# Altium schematic sheet Signal Block Diagram.SchDoc
size A
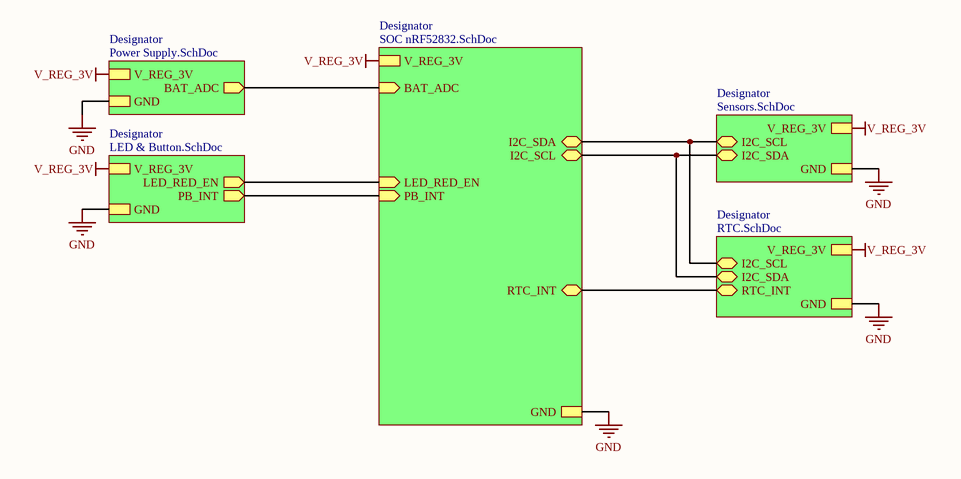
[diagram p0: Signal Block Diagram.SchDoc]

## Sub-sheets
Designator = SOC nRF52832.SchDoc: BAT_ADC (in), PB_INT (in), GND, V_REG_3V, I2C_SDA (bidir), I2C_SCL (bidir), RTC_INT (bidir), LED_RED_EN (in)
Designator = Sensors.SchDoc: GND, I2C_SDA (bidir), V_REG_3V, I2C_SCL (bidir)
Designator = LED & Button.SchDoc: GND, LED_RED_EN (out), PB_INT (out), V_REG_3V
Designator = Power Supply.SchDoc: GND, V_REG_3V, BAT_ADC (out)
Designator = RTC.SchDoc: GND, I2C_SDA (bidir), I2C_SCL (bidir), V_REG_3V, RTC_INT (bidir)

## Nets
GND: sheet Designator/GND, sheet Designator/GND, sheet Designator/GND, sheet Designator/GND, sheet Designator/GND
V_REG_3V: sheet Designator/V_REG_3V, sheet Designator/V_REG_3V, sheet Designator/V_REG_3V, sheet Designator/V_REG_3V, sheet Designator/V_REG_3V
(unnamed): sheet Designator/BAT_ADC, sheet Designator/BAT_ADC
(unnamed): sheet Designator/PB_INT, sheet Designator/PB_INT
(unnamed): sheet Designator/I2C_SDA, sheet Designator/I2C_SCL, sheet Designator/I2C_SCL
(unnamed): sheet Designator/I2C_SCL, sheet Designator/I2C_SDA, sheet Designator/I2C_SDA
(unnamed): sheet Designator/RTC_INT, sheet Designator/RTC_INT
(unnamed): sheet Designator/LED_RED_EN, sheet Designator/LED_RED_EN